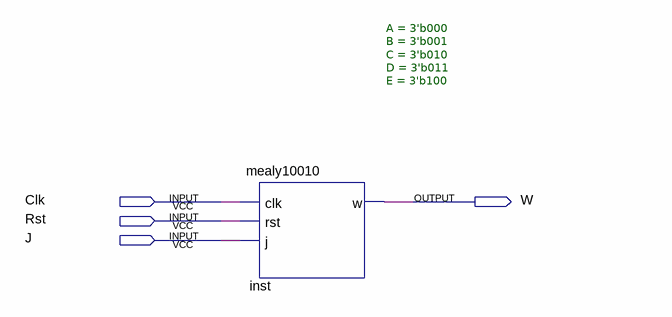
[diagram p0: schematic sheet]
// Quartus schematic mealy10010Blk.bdf as structural Verilog: 1 symbols, 4 pins
module mealy10010Blk (
  input  Clk,
  input  Rst,
  input  J,
  output W
);

  mealy10010 #(.A(3'b000), .B(3'b001), .C(3'b010), .D(3'b011), .E(3'b100)) inst (.clk(Clk), .rst(Rst), .j(J), .w(W));
endmodule
